# EAGLE design Adafruit AT42QT1010 Breakout (EAGLE 6.3)
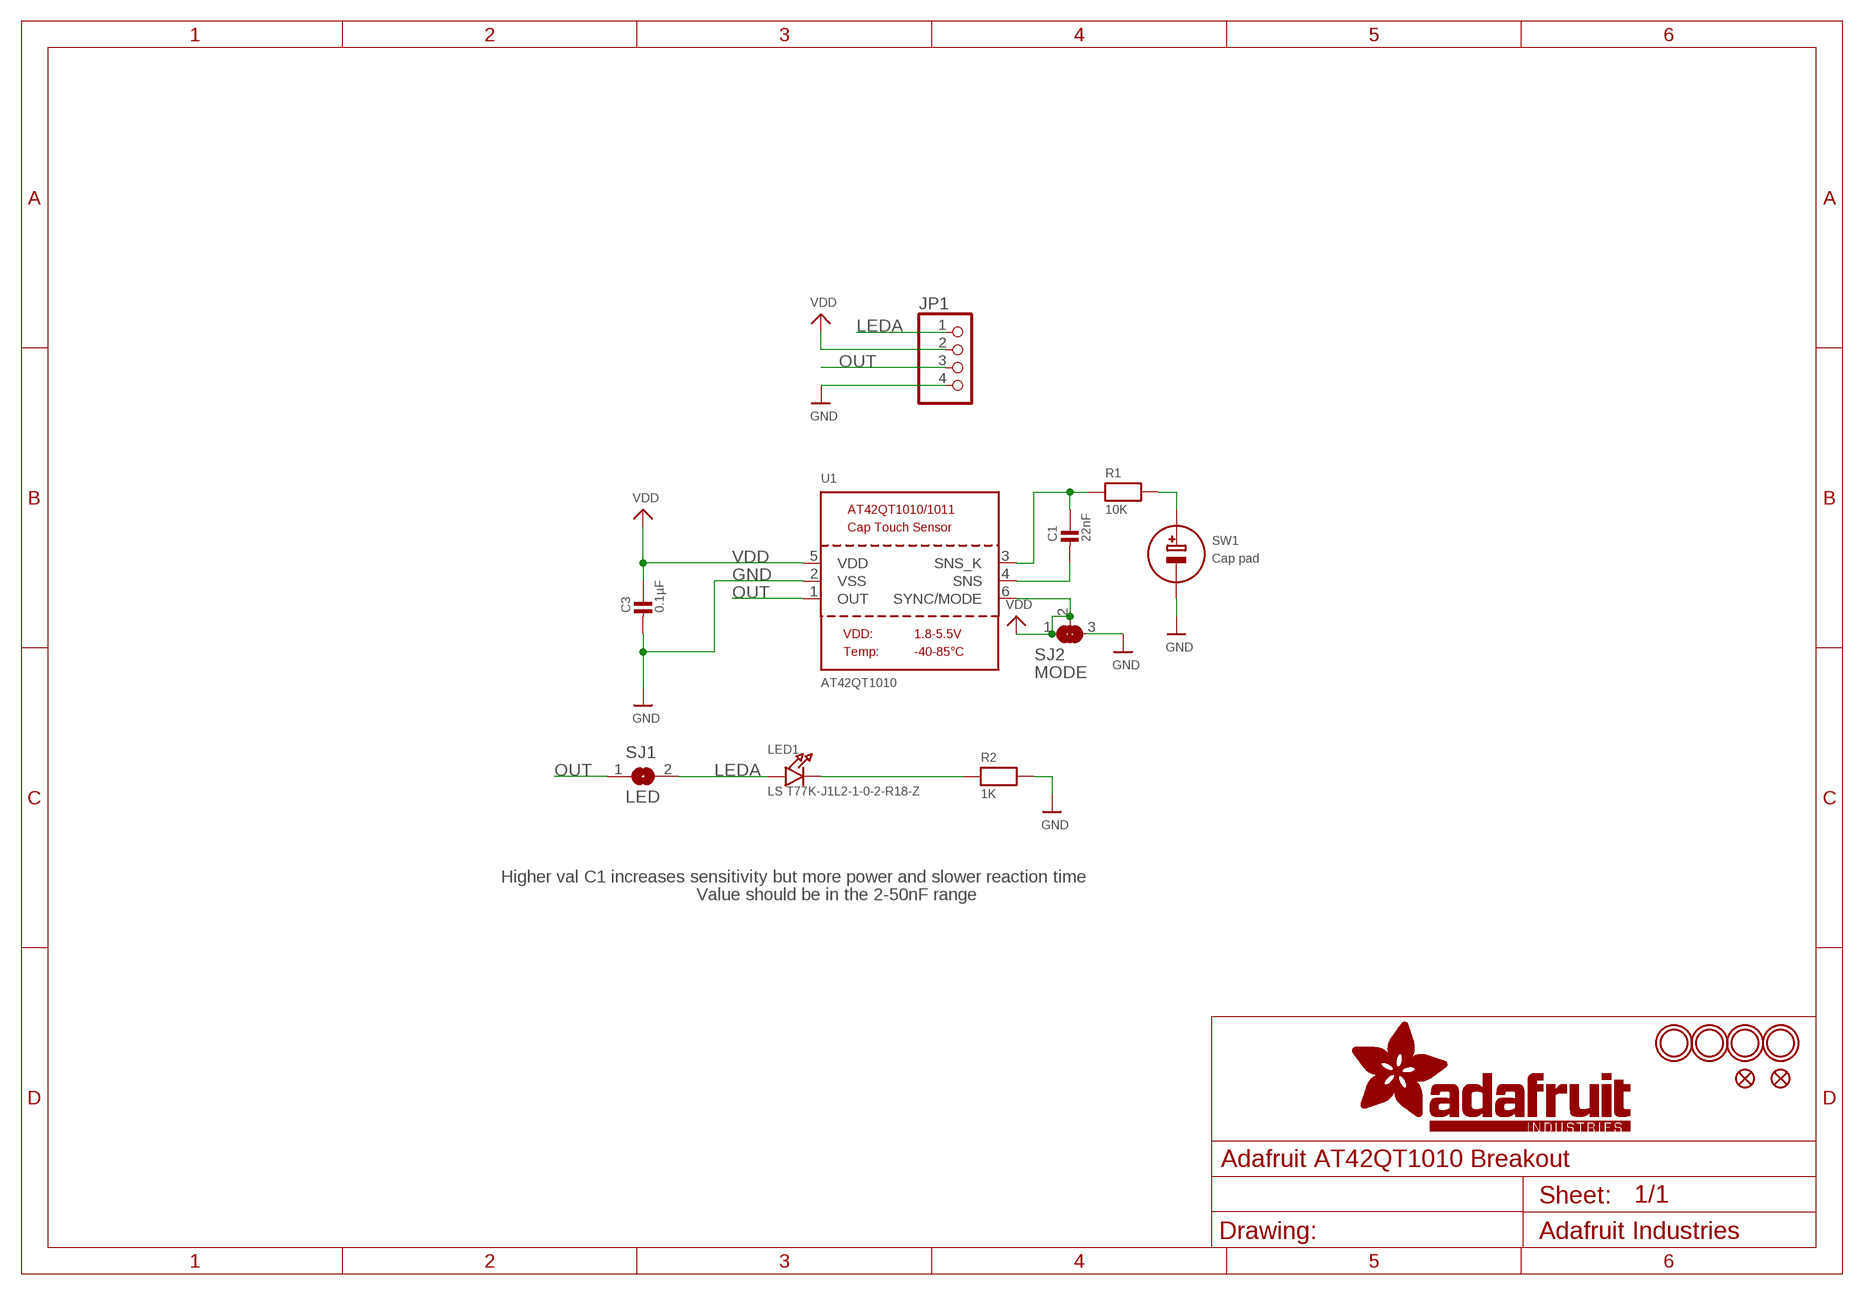
[diagram p0: schematic, sheet 1]

## Parts
C1  22nF  CAP_CERAMIC_0805  [_0805]
C3  0.1µF  CAP_CERAMIC_0805  [_0805]
FID1  FIDUCIAL""  [FIDUCIAL_1MM]
FID2  FIDUCIAL""  [FIDUCIAL_1MM]
JP1  HEADER-1X476MIL  [1X04_ROUND_76]
LED1  LS T77K-J1L2-1-0-2-R18-Z  LEDPLCC2_REV  [PLCC2_REVMOUNT]
R1  10K  RESISTOR_0805  [_0805]
R2  1K  RESISTOR_0805  [_0805]
SJ1  LED  SOLDERJUMPERCLOSED  [SOLDERJUMPER_CLOSEDWIRE]
SJ2  MODE  SOLDERJUMPER_2WAY  [SOLDERJUMPER_2WAY_OPEN_NOPASTE]
SW1  Cap pad  SWITCH_CAPTOUCHATMELAT42QT  [CAPTOUCH_SIMPLE_12.5MM]
U1  AT42QT1010  AT42QT1010/1  [SOT23-6]
U$6  MOUNTINGHOLE2.5  [MOUNTINGHOLE_2.5_PLATED]
U$9  MOUNTINGHOLE2.5  [MOUNTINGHOLE_2.5_PLATED]
U$10  MOUNTINGHOLE2.5  [MOUNTINGHOLE_2.5_PLATED]
U$11  MOUNTINGHOLE2.5  [MOUNTINGHOLE_2.5_PLATED]

## Nets
CAPPAD: R1.2 SW1.E(+)
GND: C3.2 JP1.4 R2.2 SJ2.3 SW1.G(-) U1.2(VSS)
LEDA: JP1.1 LED1.A SJ1.2
N$3: C1.2 U1.4(SNS)
N$4: C1.1 R1.1 U1.3(SNS_K)
N$6: LED1.K(C) R2.1
OUT: JP1.3 SJ1.1 U1.1(OUT)
VDD: C3.1 JP1.2 SJ2.1 SJ2.2 U1.5(VDD) U1.6(SYNC/MODE)

## Notes on the sheet
- Higher val C1 increases sensitivity but more power and slower reaction time
- Value should be in the 2-50nF range

## Library data of the parts
C1 C3 = microbuilder:CAP_CERAMIC: Ceramic Capacitors For new designs, use the packages preceded by an '_' character since they are more reliable: The following footprints should be used on most boards: _0402 - Standard footprint for regular board layouts _0603 - Standard footprint for regular board layouts _0805 - Standard footprint for regular board layouts For extremely tight-pitch boards where space is at a premium, the following 'micro-pitch' footprints can be used (smaller pads, no silkscreen outline, etc.): _0402MP - Micro-pitch footprint for very dense/compact boards _0603MP - Micro-pitch footprint for very dense/compact boards _0805MP - Micro-pitch footprint for very dense/compact boards Commonly Stocked Parts 0402 - 0402 Surface Mount Capacitors 16pF 50V 5% [Digikey: 445-4899-2-ND] 18pF 50V 5% [Digikey: 490-1281-2-ND] 22pF 50V 5% [Digikey: 490-1283-2-ND] 68pF 50V 5% [Digikey: 490-1289-2-ND] 0.1uF 10V 10% [Digikey: 490-1318-2-ND] 1.0uF 6.3V 10% [Digikey: 490-1320-2-ND] 0603 - 0603 Surface Mount Capacitors 16 pF 50V 5% [Digikey: 445-5051-2-ND] 22 pF 50V [Digikey: PCC220ACVTR-ND] 33 pF 50V 5% [Digikey: 490-1415-1-ND] 56pF 50V 5% [Digikey: 490-1421-1-ND] 220pF 50V 5% [Digikey: 445-1285-1-ND] 680 pF 50V 2200 pF 50V 5% C0G [Digikey: 445-1297-1-ND] 5600 pF 100V 5% X7R [Digikey: 478-3711-1-ND] 0.1 µF 25V 10% [Digikey: PCC2277TR-ND] 0.22 µF 16V 10% X7R [Digikey: 445-1318-1-ND] 1.0 µF 25V 10% [Digikey: 445-5146-2-ND] 0603 - RF Specific 3pF 250V +/-0.1pF RF [Digikey: 712-1347-1-ND] 18 pF 250V 5% [Digikey: 478-3505-1-ND or 712-1322-1-ND] 56 pF 250V 5% C0G RF [Digikey: 490-4867-1-ND] 68 pF 250V RF [Digikey: 490-4868-1-ND] 0805 - 0805 Surface Mount Capacitors 220 pF 250V 2% RF Ceramic Capacitor [Digikey: 712-1398-1-ND] 1000 pF 50V 2% NP0 Ceramic Capacitor [Digikey: 478-3760-1-ND] 0.1 µF 25V 10% Ceramic Capacitor [Digikey: PCC1828TR-ND] 1.0 µF 16V 10% Ceramic Capacitor[Digikey: 490-1691-2-ND] 10.0 µF 10V 10% Ceramic Capacitor[Digikey: 709-1228-1-ND] 10.0 uF 16V 10% Ceramic Capacitor [Digikey: 478-5165-2-ND] 47 uF 6.3V 20% Ceramic Capacitor [Digikey: 587-1779-1-ND or 399-5506-1-ND] 1206 - 1206 Surface Mount Capacitors 47uF 10V 20% Ceramic Capacitor [Digikey: 490-5528-1-ND or 399-5508-1-ND or 445-6010-1-ND] 100uF 6.3V -20%, +80% Y5V Ceramic Capacitor (Digikey: 490-4512-1-ND, Mouser: 81-GRM31CF50J107ZE1L)
FID1 FID2 = microbuilder:FIDUCIAL: Fiducial Alignment Points Various fiducial points for machine vision alignment.
JP1 = microbuilder:HEADER-1X4: PIN HEADER
LED1 = microbuilder:LED: LED 0603 - 0603 Surface Mount Package 2mA: Green LED - Low Power (3.9mcd, 2ma, 1.7Vf) - Digikey: 475-2709-2-ND Orange LED - Low Power (9.8mcd, 2ma, 1.8Vf) - Digikey: 475-1194-2-ND Red LED - Low Power (5mcd, 2ma, 1.8Vf) - Digikey: 475-1195-2-ND Yellow LED - Low Power (7mcd, 2ma, 1.8Vf) - Digikey: 475-1196-2-ND 5mA: Blue LED - Low Power (17mcd, 5ma, 2.9Vf) - Digikey: LNJ937W8CRACT-ND 0805 - 0805 Surface Mount Package 2mA: Red LED (8.8mcd, 2mA, 1.8Vf, Clear) - Low Power [Digikey: 475-2510-1-ND] Green LED (5mcd, 2mA, 1.8Vf, Clear) - Low Power [Digikey: 475-2730-1-ND] Yellow LED (11.3mcd, 2mA, 1.8Vf, Clear) - Low Power [Digikey: 475-2555-1-ND] 20mA: Red LED (104mcd, 20mA, Diffused) - LS R976 [Digikey: 475-1278-6-ND] Red LED (12mcd, 20mA, 2.0Vf, Clear) - APT2012EC [Digikey: 754-1128-1-ND] Green LED (15mcd, 20mA, 2.2Vf, Clear) - APT2012GC [Digikey: 754-1131-1-ND] Orange LED (160mcd, 20mA, 2.1Vf, Clear) - APT2012SECK [Digikey: 754-1130-1-ND] 1206 - 1206 Surface Mount Package Green LED (26mcd, 20mA, Diffused) - LG N971 [Digikey: 475-1407-6-ND] Red LED (15mcd, 20mA, Diffused) - LH N974 [Digikey: 475-1416-6-ND] Cree - Cree High-Power Surface Mount LEDs XPEBWT-L1-0000-00D50 - White 111lm 350mA 2.9Vf 6200K 110° XTEAWT-00-0000-00000LEE3 - White 114lm 350mA 2.85Vf 5000K 115° Everlight - Everlight 45-21 Series Surface Mount LEDs 45-21/QK2C-B2832AC2CB2/2T - Warm White 2000mcd 20mA 3.25Vf 3050K 120° 45-21/LK2C-B38452C4CB2/2T - Nuetral White 2000mcd 20mA 3.25Vf 4150K 120° 45-21/LK2C-B50634C6CB2/2T - Cold White 2200mcd 20mA 3.25Vf 5650K 120° PLCC2 Reverse Mount LS T77K-J1L2-1-0-2-R18-Z - Red 11.25mcd 2mA 1.8Vf 630nm 120° LO T77K-L1M2-24-Z - Orange 19.6mcd 2mA 1.8Vf 606nm 120° LY T77K-K2M1-26-Z - Yellow 15.7mcd 2mA 1.8Vf 587nm 120°
R1 R2 = microbuilder:RESISTOR: Resistors For new designs, use the packages preceded by an '_' character since they are more reliable: The following footprints should be used on most boards: _0402 - Standard footprint for regular board layouts _0603 - Standard footprint for regular board layouts _0805 - Standard footprint for regular board layouts For extremely tight-pitch boards where space is at a premium, the following 'micro-pitch' footprints can be used (smaller pads, no silkscreen outline, etc.): _0402MP - Micro-pitch footprint for very dense/compact boards _0603MP - Micro-pitch footprint for very dense/compact boards _0805MP - Micro-pitch footprint for very dense/compact boards
SJ1 = microbuilder:SOLDERJUMPER: SMD Solder JUMPER Solder the two pads together to create a connection, or remove the solder to break it. REFLOW - Use this footprint for solder paste and reflow ovens. WAVE - Use this footprint for hand-soldering (larger pads). CLOSED - Has a trace between the two pads to ensure it is closed by default. The trace needs to be cut to disable the jumper, and can be closed again by creating a solder bridge between the two pads.
SJ2 = microbuilder:SOLDERJUMPER_2WAY: 2-Way Solder Jumper
SW1 = microbuilder:SWITCH_CAPTOUCH: Capacitive Touch Electrodes
U1 = microbuilder:AT42QT1010/1: AT42QT1010/1011 - Single Button Cap Touch Sensors AT42QT1010 - Auto recalibration AT42QT1011 - Remains on as long as touch is detected
U$6 U$9-U$11 = microbuilder:MOUNTINGHOLE: Mounting Hole For #2 screws (0.086"/2.18mm width, 0.094"/2.4mm hole) use 2.5mm

## Board
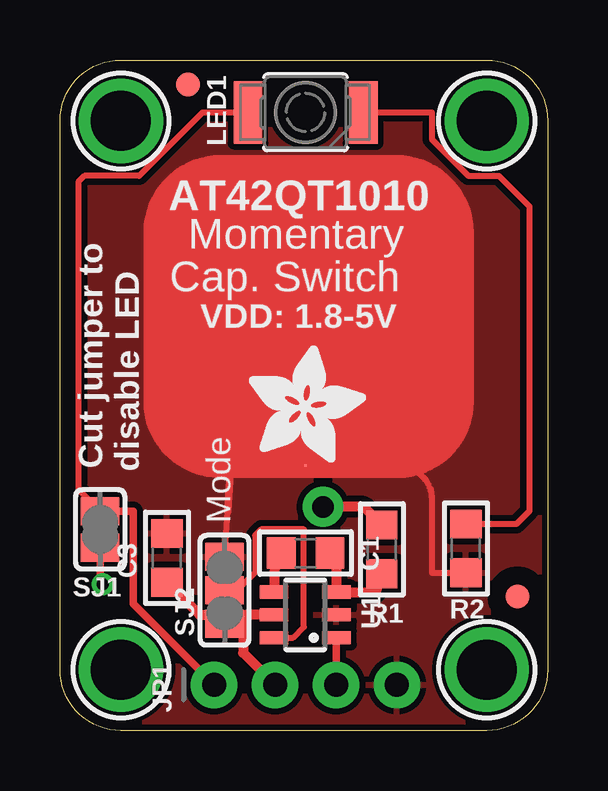
[diagram p1: board, top side]
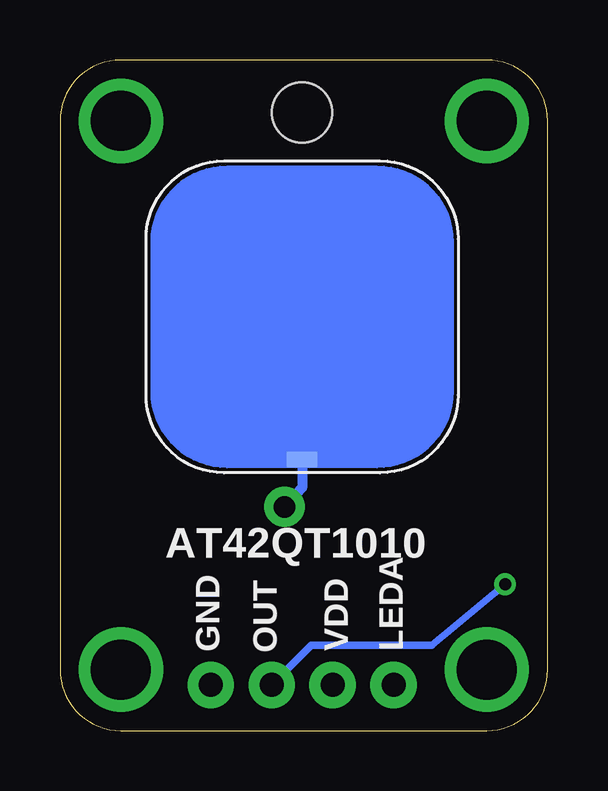
[diagram p2: board, bottom side, seen from below]

Size 20.32 x 27.94 mm. Coordinates in mm from the lower left corner, seen from the top.
Outline: 17.78,0 2.54,0 arc-90 0,2.54 0,25.4 arc-90 2.54,27.94 17.78,27.94 arc-90 20.32,25.4 20.32,2.54 arc-90 17.78,0
Copper layers (1*16): Top 0.035mm / dielectric 1.5mm / Bottom 0.035mm
Design rules "adafruit *": minimum track width 8mil, minimum drill 16mil, track to track 8mil, track to pad 8mil, pad to pad 8mil, via to via 8mil, smd to smd 8mil, copper to edge 10mil, drill to drill 8mil, minimum pad ring 10mil, minimum via ring 8mil, stop-mask expansion 4mil, vias tented up to drill 20mil, thermal gap 10mil
tRestrict: area 4.5,11 to 16,23

### Footprints (pad centres in the part's own frame; a part is rotated, then mirrored left to right if it is on the bottom)
_0805 = smd 1.2 x 1.3: 1 -1.016,0; 2 1.016,0
FIDUCIAL_1MM = smd 1 x 1: 1 0,0
1X04_ROUND_76 = drill 1 pad 1.93: 1 -3.81,0; 2 -1.27,0; 3 1.27,0; 4 3.81,0
PLCC2_REVMOUNT = smd 1.2 x 2.6: A 2.4,0; K -2.4,0 | hole 2.5: 0,0
SOLDERJUMPER_CLOSEDWIRE = smd 1.168 x 1.6: 1 -0.762,0; 2 0.762,0 | smd 0.635 x 0.203: WIRE 0,0
SOLDERJUMPER_2WAY_OPEN_NOPASTE = smd 1.168 x 1.6: 1 -1.397,0; 2 0,0; 3 1.397,0
CAPTOUCH_SIMPLE_12.5MM = smd 1.27 x 0.635: E 0,-5.95 | smd 0.1 x 0.1 bottom: G 0,-6.2
SOT23-6 = smd 0.55 x 1.2: 1 -0.95,-1.3; 2 0,-1.3; 3 0.95,-1.3; 4 0.95,1.3; 5 0,1.3; 6 -0.95,1.3
MOUNTINGHOLE_2.5_PLATED = drill 2.5 pad 3.2: P$1 0,0

### Placement (x,y rotation side)
C1  10.23,7.4 180 top
C3  4.46,7.2 90 top
FID1  19.07,5.59 0 top
FID2  5.33,26.92 0 top
JP1  10.23,1.91 0 top
LED1  10.23,25.76 180 top
R1  13.41,7.55 90 top
R2  16.91,7.59 270 top
SJ1  1.68,8.38 90 top
SJ2  6.86,5.84 90 top
SW1  10.23,17.24 0 bottom
U1  10.22,4.82 90 top
U$6  17.78,2.54 0 top
U$9  2.54,2.54 0 top
U$10  17.78,25.4 0 top
U$11  2.54,25.4 0 top
U$12  [ADAFRUIT_5MM]  7.87,11.18 0 top

### Tracks (layer width: path | path; a pad name or v marks a point on that pad's centre or on a via)
CAPPAD  (via drill 0.9 pad 1.68)
  Top 0.406: R1.2 12.65,9.32 v10.96,9.32
  Bottom 0.406: SW1.E 10.23,10.11 v10.96,9.32
GND
  Top 0.254: 14.08,11.03 arc-90 15.49,9.62 15.49,6.6 arc90 15.53,6.57 R2.2 | SJ2.3 6.99,9.15 7,9.15
  Top 0.305: 7,9.15 7.11,11.04
  Top 1.016: SW1.G 7.11,11.04 6.67,11.04 arc-90 3.98,13.73 3.98,20.73 arc-90 6.73,23.48 13.98,23.48 | 13.98,23.48 arc-90 16.73,20.73 16.73,13.73 arc-90 14.08,11.03 10.33,11.03 | 14.03,23.43 arc-90 13.98,23.48
  pour Top (isolate 0.254): 0,0 0,28.7 20.32,28.7 20.32,0
LEDA
  Top 0.254: SJ1.2 0.76,10.06 0.76,22.86 1.02,23.11 3.3,23.11 5.95,25.76 LED1.A
  Top 0.305: JP1.1 3.05,5.28 3.05,9.14 SJ1.2
N$3
  Top 0.406: U1.4 8.96,7 C1.2
N$4
  Top 0.406: C1.1 11.52,7.12 U1.3 13.16,5.77 R1.1
N$6
  Top 0.254: LED1.K 15.49,25.76 15.49,24.64 17.02,23.11 18.29,23.11 19.56,21.84 19.56,9.14 19.02,8.6 R2.1
  Top 0.406: 12.68,25.8 LED1.K
OUT  (via drill 0.5)
  Top 0.305: SJ1.1 1.68,6.45 v1.78,6.1 | U1.1 11.52,1.93 JP1.3
  Bottom 0.305: v1.78,6.1 4.83,3.56 9.85,3.56 JP1.3
VDD
  Top 0.254: 8.86,3.81 U1.6 9.71,3.87 10.16,4.32 10.16,8.38 8.38,8.38 8.13,8.13 8.13,6.6 7.62,6.1 7.11,6.1 SJ2.2 SJ2.1 6.86,5.07
  Top 0.305: 5.82,4.82 6.48,4.82 SJ2.1
  Top 0.406: U1.5 7.73,4.82 | 7.73,4.82 7.63,4.72 7.63,3.23 JP1.2 | C3.1 5.82,4.82 7.73,4.82

### Text on the board
tPlace: AT42QT1010 | Momentary | Cap. Switch | VDD: 1.8-5V | Cut jumper to | disable LED | Mode
bPlace: AT42QT1010 | LEDA | VDD | OUT | GND